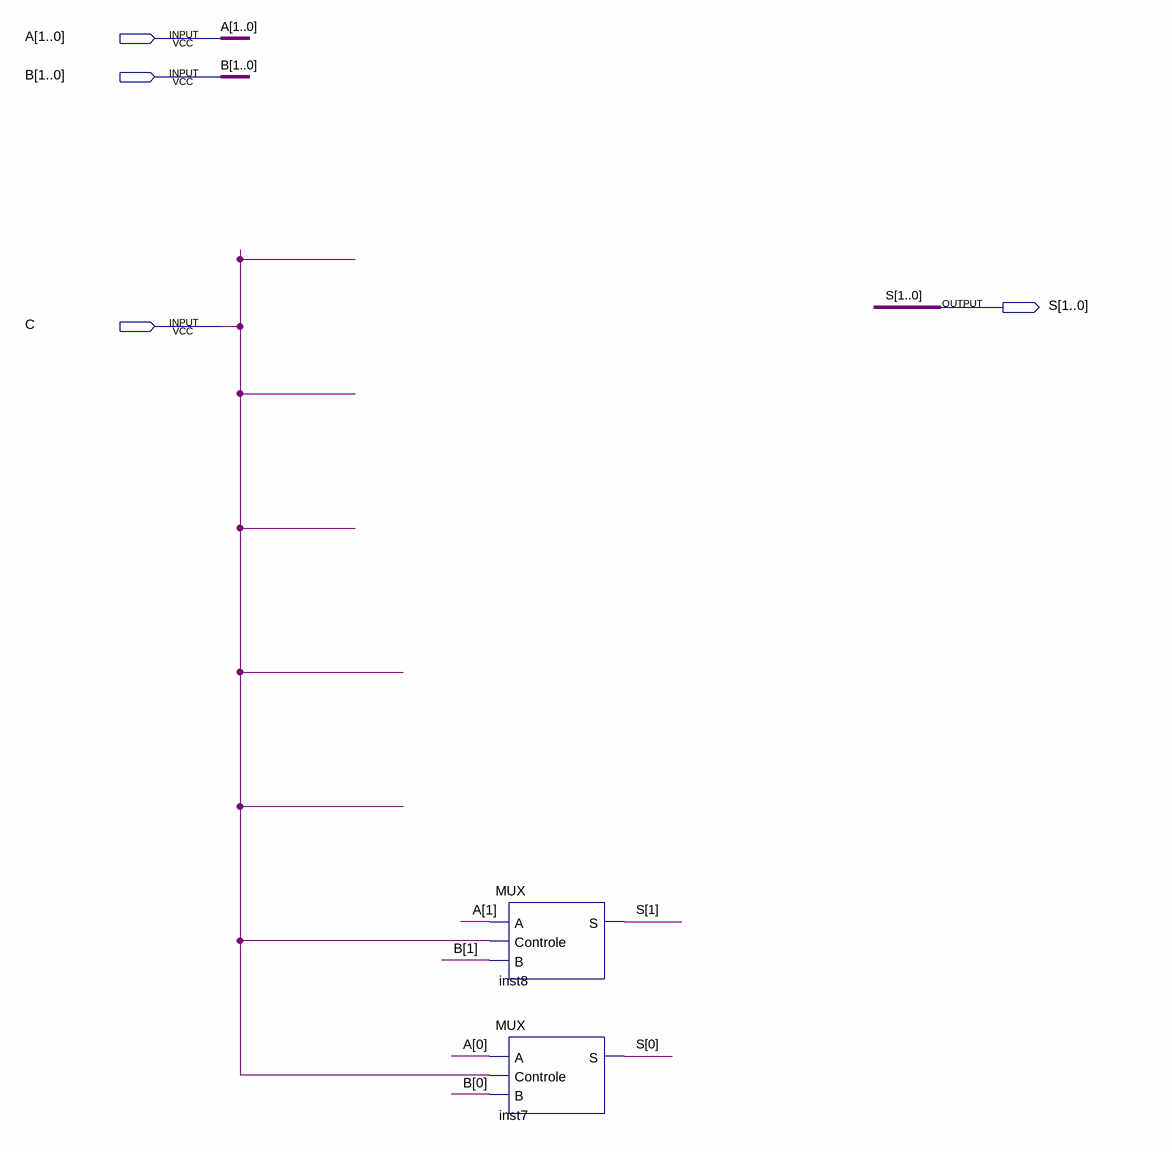
[diagram p0: schematic sheet]
// Quartus schematic MUX2BIT.bdf as structural Verilog: 2 symbols, 4 pins
module MUX2BIT (
  input  [1:0] A,
  input  [1:0] B,
  input  C,
  output [1:0] S
);

  MUX inst8 (.A(A[1]), .Controle(C), .B(B[1]), .S(S[1]));
  MUX inst7 (.A(A[0]), .Controle(C), .B(B[0]), .S(S[0]));
endmodule
